# Altium schematic sheet MEGA PROJECT.SchDoc
size A
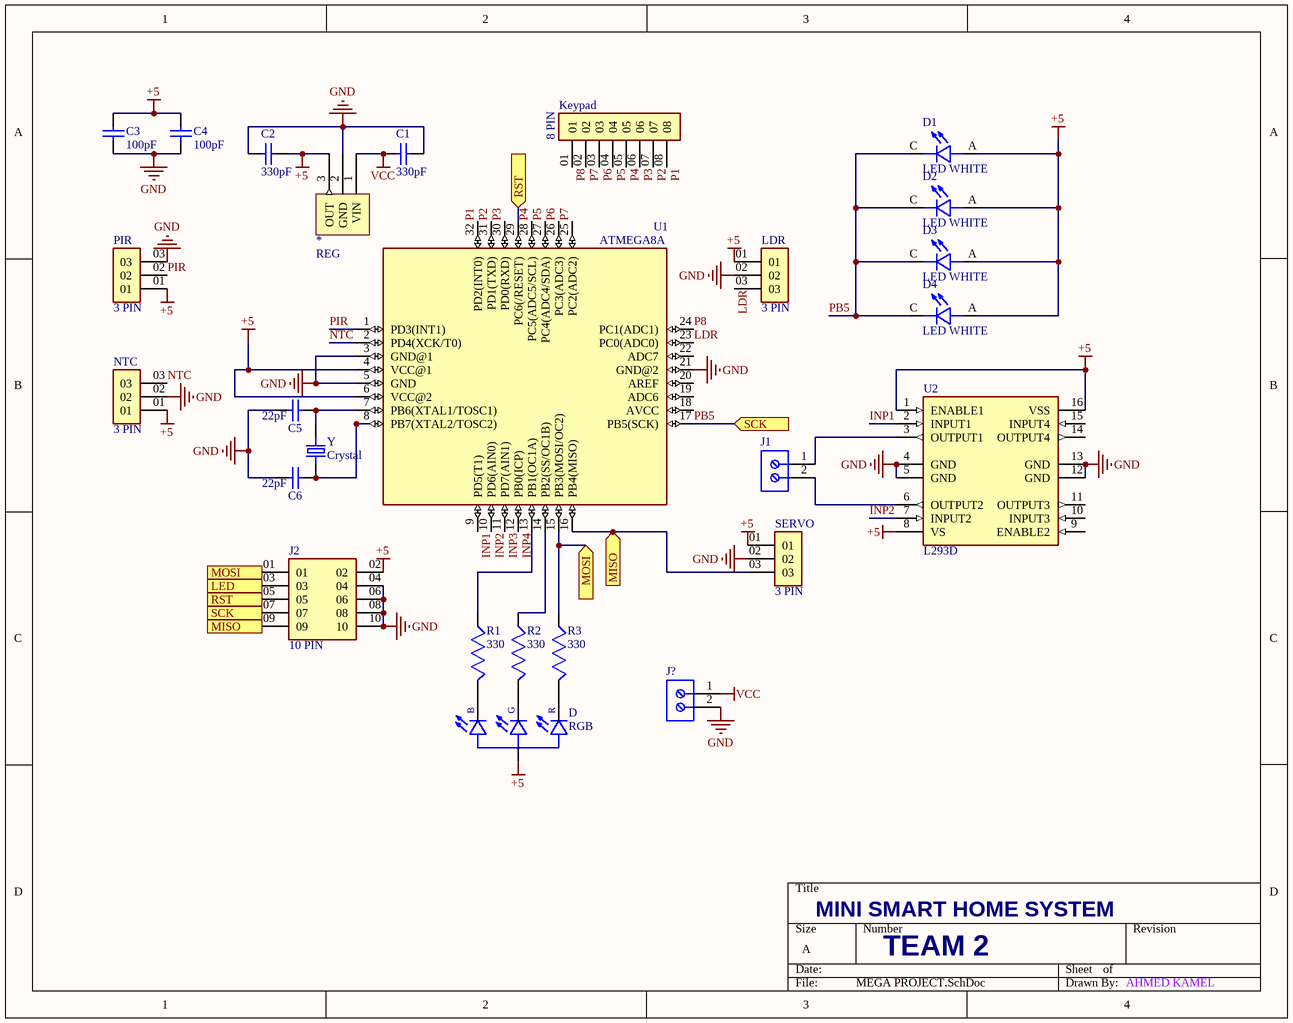
[diagram p0: MEGA PROJECT.SchDoc]

## Parts
*  REG  [REG]
C1  330pF  [CAP]
C2  330pF  [CAP]
C3  100pF  [CAP]
C4  100pF  [CAP]
C5  22pF  [CAP]
C6  22pF  [CAP]
D  RGB  [RGB]
D1  LED WHITE  [LED WHITE]
D2  LED WHITE  [LED WHITE]
D3  LED WHITE  [LED WHITE]
D4  LED WHITE  [LED WHITE]
J1  691214110002  [691214110002]  (value not drawn)
J2  10 PIN  [10 PIN]
J?  691214110002  [691214110002]  (value not drawn)
Keypad  8 PIN  [8 PIN]
LDR  3 PIN  [3 PIN]
NTC  3 PIN  [3 PIN]
PIR  3 PIN  [3 PIN]
R1  330  [RES]
R2  330  [RES]
R3  330  [RES]
SERVO  3 PIN  [3 PIN]
U1  ATMEGA8A  [ATMEGA8A]
U2  L293D  [L293D]
Y  Crystal  [Crystil]

## Ports
LED (in), MISO (in), MOSI (in), RST (in), SCK (in)

## Nets
+5: *.3(OUT) C2.2 C3.2 C4.2 D.1 D1.A D2.A D3.A D4.A J2.02 LDR.01 NTC.01 PIR.01 SERVO.01 U1.4(VCC@1) U1.6(VCC@2) U2.1(ENABLE1) U2.8(VS) U2.16(VSS)
GND: *.2(GND) C1.2 C2.1 C3.1 C4.1 C5.1 C6.1 J2.04 J2.06 J2.08 J2.10 J?.2 LDR.02 NTC.02 PIR.03 SERVO.02 U1.3(GND@1) U1.5(GND) U1.21(GND@2) U2.4(GND) U2.5(GND) U2.12(GND) U2.13(GND)
VCC: *.1(VIN) C1.1 J?.1
INP1: U1.9(PD5(T1)) U2.2(INPUT1)
INP2: U1.10(PD6(AIN0)) U2.7(INPUT2)
INP3: U1.11(PD7(AIN1))
INP4: U1.12(PB0(ICP))
LDR: LDR.03 U1.23(PC0(ADC0))
LED: J2.03 ; port LED
MISO: J2.09 SERVO.03 U1.16(PB4(MISO)) ; port MISO
MOSI: J2.01 R3.2 U1.15(PB3(MOSI/OC2)) ; port MOSI
NTC: NTC.03 U1.2(PD4(XCK/T0))
P1: Keypad.08 U1.32(PD2(INT0))
P2: Keypad.07 U1.31(PD1(TXD))
P3: Keypad.06 U1.30(PD0(RXD))
P4: Keypad.05 U1.28(PC5(ADC5/SCL))
P5: Keypad.04 U1.27(PC4(ADC4/SDA))
P6: Keypad.03 U1.26(PC3(ADC3))
P7: Keypad.02 U1.25(PC2(ADC2))
P8: Keypad.01 U1.24(PC1(ADC1))
PB5: D1.C D2.C D3.C D4.C J2.07 U1.17(PB5(SCK)) ; port SCK
PIR: PIR.02 U1.1(PD3(INT1))
RST: J2.05 U1.29(PC6(/RESET)) ; port RST
NetC5_2: C5.2 U1.7(PB6(XTAL1/TOSC1)) Y.2
NetC6_2: C6.2 U1.8(PB7(XTAL2/TOSC2)) Y.1
NetD_2: D.2 R3.1
NetD_3: D.3 R1.1
NetD_4: D.4 R2.1
NetJ1_1: J1.1 U2.3(OUTPUT1)
NetJ1_2: J1.2 U2.6(OUTPUT2)
NetR1_2: R1.2 U1.13(PB1(OC1A))
NetR2_2: R2.2 U1.14(PB2(SS/OC1B))

Not connected (* = marked no-connect by the designer): U1 18(AVCC) 19(ADC6) 20(AREF) 22(ADC7); U2 9(ENABLE2) 10(INPUT3) 11(OUTPUT3) 14(OUTPUT4) 15(INPUT4)

## Notes on the sheet
- MINI SMART HOME SYSTEM
- TEAM 2
- AHMED KAMEL
- (in symbol RGB) B; G; R

## Library data of the parts
C1-C6 = CAP: Multilayer Ceramic Capacitors MLCC SMD/SMT
D = RGB: LED; SMD; 0603; RGB;; MP: RGB SMD; MF: OptoSupply; SnapEDA_Link: https://makerselectronics.com/product/rgb-smd-led-0603-common-cathode
D1-D4 = LED WHITE: LED SMD 1206 Warm White
J1 J? = CMP-1502-02464-2: NexarPartId: 18818288; Plating: Brass, Steel; Current: 10A; Pitch: 3.5052mm; Number of Levels: 1; Number of Contacts: 2; Wire Gauge (Min): 16AWG; Voltage: 300V; Wire Gauge (Max): 24AWG; Stripping Length: -6mm; Number of Pins: 2; Number of Rows: 1; REACH SVHC: Unknown; RoHS: Compliant; Housing Material: Nylon; Termination: Screw; Mount: Through Hole; Contact Plating: Brass, Tin; Number of Positions Per Level: 2; Color: Blue, Green; Width: 7.9mm; Voltage Rating: 300V; Length: 7.4mm; Current Rating: 10A; Wire/Cable Gauge: 24AWG; Packaging: Box; Max Operating Temperature: 105°C; Lead Pitch: 3.5mm; Height: 8.7mm; Contact Material: Brass; Min Operating Temperature: -40°C
R1-R3 = RES
U1 = ATMEGA8A: ATmega Microcontroller IC 8-Bit 16MHz 8KB (4K x 16) FLASH; MF: Microchip; MP: ATMEGA8A-AU; Purchase-URL: https://makerselectronics.com/product/atmega8a-au-8-bit-avr-microcontroller-8kb-1kb-flash-23-2-7v5-5v-avr-16mhz-tqfp-32
U2 = L293D: Bipolar Motor Driver - Parallel 16-PowerDIP; MF: STMicroelectronics; MP: L293D; Purchase-URL: https://makerselectronics.com/product/l293d-quadruple-half-h-driver-dip-16
Y = Crystal: Crystal 16.000MHz 49S 20PPM 20pF 40Ω; MF: ECS Inc.; MP: ECS-160-S-4; Link: https://makerselectronics.com/product/crystal-16-000mhz-49s-20ppm-20pf-40%cf%89